# Altium project Service_board.PrjPcb (part 7 of 9)
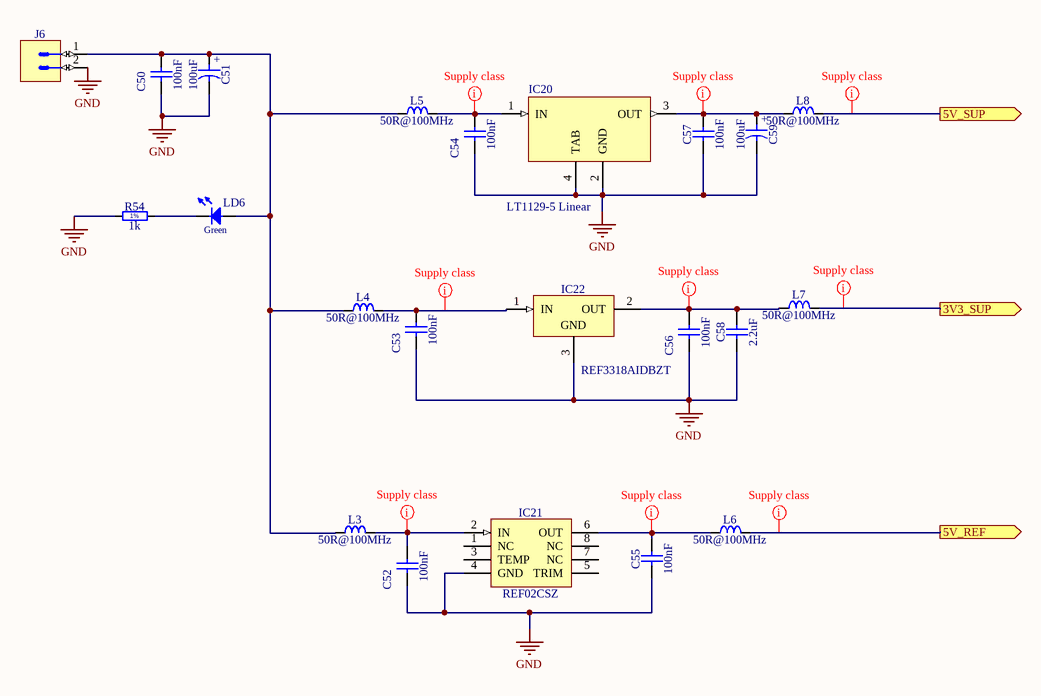
[diagram p12: Regulators.SchDoc]
## Nets that join several sheets
DVDD: MCU (32 pins), U_Bank (C1_U_Bank#1.2 IC1_U_Bank#1.16), U_Bank/U_Channel/U_TRD (C45_U_Bank_U_Channel_U_TRD#1.2 C46_U_Bank_U_Channel_U_TRD#1.1 U2_U_Bank_U_Channel_U_TRD#1.19 U2_U_Bank_U_Channel_U_TRD#1.20), U_Bank/U_Channel/U_TRD (C45_U_Bank_U_Channel_U_TRD#2.2 C46_U_Bank_U_Channel_U_TRD#2.1 U2_U_Bank_U_Channel_U_TRD#2.19 U2_U_Bank_U_Channel_U_TRD#2.20), U_Bank/U_Channel/U_TRD (C45_U_Bank_U_Channel_U_TRD#3.2 C46_U_Bank_U_Channel_U_TRD#3.1 U2_U_Bank_U_Channel_U_TRD#3.19 U2_U_Bank_U_Channel_U_TRD#3.20), U_Bank/U_Channel/U_TRD (C45_U_Bank_U_Channel_U_TRD#4.2 C46_U_Bank_U_Channel_U_TRD#4.1 U2_U_Bank_U_Channel_U_TRD#4.19 U2_U_Bank_U_Channel_U_TRD#4.20), U_Bank/U_Channel/U_TRD (C45_U_Bank_U_Channel_U_TRD#5.2 C46_U_Bank_U_Channel_U_TRD#5.1 U2_U_Bank_U_Channel_U_TRD#5.19 U2_U_Bank_U_Channel_U_TRD#5.20), U_Bank/U_Channel/U_TRD (C45_U_Bank_U_Channel_U_TRD#6.2 C46_U_Bank_U_Channel_U_TRD#6.1 U2_U_Bank_U_Channel_U_TRD#6.19 U2_U_Bank_U_Channel_U_TRD#6.20), U_Bank/U_Channel/U_TRD (C45_U_Bank_U_Channel_U_TRD#7.2 C46_U_Bank_U_Channel_U_TRD#7.1 U2_U_Bank_U_Channel_U_TRD#7.19 U2_U_Bank_U_Channel_U_TRD#7.20), U_Bank/U_Channel/U_TRD (C45_U_Bank_U_Channel_U_TRD#8.2 C46_U_Bank_U_Channel_U_TRD#8.1 U2_U_Bank_U_Channel_U_TRD#8.19 U2_U_Bank_U_Channel_U_TRD#8.20), DAC (C49.2 IC18.12 IC18.15), Regulators (L7.2), U_Bank (C1_U_Bank#2.2 IC1_U_Bank#2.16), U_Bank/U_Channel/U_TRD (C45_U_Bank_U_Channel_U_TRD#9.2 C46_U_Bank_U_Channel_U_TRD#9.1 U2_U_Bank_U_Channel_U_TRD#9.19 U2_U_Bank_U_Channel_U_TRD#9.20), U_Bank/U_Channel/U_TRD (C45_U_Bank_U_Channel_U_TRD#10.2 C46_U_Bank_U_Channel_U_TRD#10.1 U2_U_Bank_U_Channel_U_TRD#10.19 U2_U_Bank_U_Channel_U_TRD#10.20), U_Bank/U_Channel/U_TRD (C45_U_Bank_U_Channel_U_TRD#11.2 C46_U_Bank_U_Channel_U_TRD#11.1 U2_U_Bank_U_Channel_U_TRD#11.19 U2_U_Bank_U_Channel_U_TRD#11.20), U_Bank/U_Channel/U_TRD (C45_U_Bank_U_Channel_U_TRD#12.2 C46_U_Bank_U_Channel_U_TRD#12.1 U2_U_Bank_U_Channel_U_TRD#12.19 U2_U_Bank_U_Channel_U_TRD#12.20), U_Bank/U_Channel/U_TRD (C45_U_Bank_U_Channel_U_TRD#13.2 C46_U_Bank_U_Channel_U_TRD#13.1 U2_U_Bank_U_Channel_U_TRD#13.19 U2_U_Bank_U_Channel_U_TRD#13.20), U_Bank/U_Channel/U_TRD (C45_U_Bank_U_Channel_U_TRD#14.2 C46_U_Bank_U_Channel_U_TRD#14.1 U2_U_Bank_U_Channel_U_TRD#14.19 U2_U_Bank_U_Channel_U_TRD#14.20), U_Bank/U_Channel/U_TRD (C45_U_Bank_U_Channel_U_TRD#15.2 C46_U_Bank_U_Channel_U_TRD#15.1 U2_U_Bank_U_Channel_U_TRD#15.19 U2_U_Bank_U_Channel_U_TRD#15.20), U_Bank/U_Channel/U_TRD (C45_U_Bank_U_Channel_U_TRD#16.2 C46_U_Bank_U_Channel_U_TRD#16.1 U2_U_Bank_U_Channel_U_TRD#16.19 U2_U_Bank_U_Channel_U_TRD#16.20), U_Bank (C1_U_Bank#3.2 IC1_U_Bank#3.16), U_Bank/U_Channel/U_TRD (C45_U_Bank_U_Channel_U_TRD#17.2 C46_U_Bank_U_Channel_U_TRD#17.1 U2_U_Bank_U_Channel_U_TRD#17.19 U2_U_Bank_U_Channel_U_TRD#17.20), U_Bank/U_Channel/U_TRD (C45_U_Bank_U_Channel_U_TRD#18.2 C46_U_Bank_U_Channel_U_TRD#18.1 U2_U_Bank_U_Channel_U_TRD#18.19 U2_U_Bank_U_Channel_U_TRD#18.20), U_Bank/U_Channel/U_TRD (C45_U_Bank_U_Channel_U_TRD#19.2 C46_U_Bank_U_Channel_U_TRD#19.1 U2_U_Bank_U_Channel_U_TRD#19.19 U2_U_Bank_U_Channel_U_TRD#19.20), U_Bank/U_Channel/U_TRD (C45_U_Bank_U_Channel_U_TRD#20.2 C46_U_Bank_U_Channel_U_TRD#20.1 U2_U_Bank_U_Channel_U_TRD#20.19 U2_U_Bank_U_Channel_U_TRD#20.20), U_Bank/U_Channel/U_TRD (C45_U_Bank_U_Channel_U_TRD#21.2 C46_U_Bank_U_Channel_U_TRD#21.1 U2_U_Bank_U_Channel_U_TRD#21.19 U2_U_Bank_U_Channel_U_TRD#21.20), U_Bank/U_Channel/U_TRD (C45_U_Bank_U_Channel_U_TRD#22.2 C46_U_Bank_U_Channel_U_TRD#22.1 U2_U_Bank_U_Channel_U_TRD#22.19 U2_U_Bank_U_Channel_U_TRD#22.20), U_Bank/U_Channel/U_TRD (C45_U_Bank_U_Channel_U_TRD#23.2 C46_U_Bank_U_Channel_U_TRD#23.1 U2_U_Bank_U_Channel_U_TRD#23.19 U2_U_Bank_U_Channel_U_TRD#23.20), U_Bank/U_Channel/U_TRD (C45_U_Bank_U_Channel_U_TRD#24.2 C46_U_Bank_U_Channel_U_TRD#24.1 U2_U_Bank_U_Channel_U_TRD#24.19 U2_U_Bank_U_Channel_U_TRD#24.20), U_Bank (C1_U_Bank#4.2 IC1_U_Bank#4.16), U_Bank/U_Channel/U_TRD (C45_U_Bank_U_Channel_U_TRD#25.2 C46_U_Bank_U_Channel_U_TRD#25.1 U2_U_Bank_U_Channel_U_TRD#25.19 U2_U_Bank_U_Channel_U_TRD#25.20), U_Bank/U_Channel/U_TRD (C45_U_Bank_U_Channel_U_TRD#26.2 C46_U_Bank_U_Channel_U_TRD#26.1 U2_U_Bank_U_Channel_U_TRD#26.19 U2_U_Bank_U_Channel_U_TRD#26.20), U_Bank/U_Channel/U_TRD (C45_U_Bank_U_Channel_U_TRD#27.2 C46_U_Bank_U_Channel_U_TRD#27.1 U2_U_Bank_U_Channel_U_TRD#27.19 U2_U_Bank_U_Channel_U_TRD#27.20), U_Bank/U_Channel/U_TRD (C45_U_Bank_U_Channel_U_TRD#28.2 C46_U_Bank_U_Channel_U_TRD#28.1 U2_U_Bank_U_Channel_U_TRD#28.19 U2_U_Bank_U_Channel_U_TRD#28.20), U_Bank/U_Channel/U_TRD (C45_U_Bank_U_Channel_U_TRD#29.2 C46_U_Bank_U_Channel_U_TRD#29.1 U2_U_Bank_U_Channel_U_TRD#29.19 U2_U_Bank_U_Channel_U_TRD#29.20), U_Bank/U_Channel/U_TRD (C45_U_Bank_U_Channel_U_TRD#30.2 C46_U_Bank_U_Channel_U_TRD#30.1 U2_U_Bank_U_Channel_U_TRD#30.19 U2_U_Bank_U_Channel_U_TRD#30.20), U_Bank/U_Channel/U_TRD (C45_U_Bank_U_Channel_U_TRD#31.2 C46_U_Bank_U_Channel_U_TRD#31.1 U2_U_Bank_U_Channel_U_TRD#31.19 U2_U_Bank_U_Channel_U_TRD#31.20), U_Bank/U_Channel/U_TRD (C45_U_Bank_U_Channel_U_TRD#32.2 C46_U_Bank_U_Channel_U_TRD#32.1 U2_U_Bank_U_Channel_U_TRD#32.19 U2_U_Bank_U_Channel_U_TRD#32.20), U_Bank (C1_U_Bank#5.2 IC1_U_Bank#5.16), U_Bank/U_Channel/U_TRD (C45_U_Bank_U_Channel_U_TRD#33.2 C46_U_Bank_U_Channel_U_TRD#33.1 U2_U_Bank_U_Channel_U_TRD#33.19 U2_U_Bank_U_Channel_U_TRD#33.20), U_Bank/U_Channel/U_TRD (C45_U_Bank_U_Channel_U_TRD#34.2 C46_U_Bank_U_Channel_U_TRD#34.1 U2_U_Bank_U_Channel_U_TRD#34.19 U2_U_Bank_U_Channel_U_TRD#34.20), U_Bank/U_Channel/U_TRD (C45_U_Bank_U_Channel_U_TRD#35.2 C46_U_Bank_U_Channel_U_TRD#35.1 U2_U_Bank_U_Channel_U_TRD#35.19 U2_U_Bank_U_Channel_U_TRD#35.20), U_Bank/U_Channel/U_TRD (C45_U_Bank_U_Channel_U_TRD#36.2 C46_U_Bank_U_Channel_U_TRD#36.1 U2_U_Bank_U_Channel_U_TRD#36.19 U2_U_Bank_U_Channel_U_TRD#36.20), U_Bank/U_Channel/U_TRD (C45_U_Bank_U_Channel_U_TRD#37.2 C46_U_Bank_U_Channel_U_TRD#37.1 U2_U_Bank_U_Channel_U_TRD#37.19 U2_U_Bank_U_Channel_U_TRD#37.20), U_Bank/U_Channel/U_TRD (C45_U_Bank_U_Channel_U_TRD#38.2 C46_U_Bank_U_Channel_U_TRD#38.1 U2_U_Bank_U_Channel_U_TRD#38.19 U2_U_Bank_U_Channel_U_TRD#38.20), U_Bank/U_Channel/U_TRD (C45_U_Bank_U_Channel_U_TRD#39.2 C46_U_Bank_U_Channel_U_TRD#39.1 U2_U_Bank_U_Channel_U_TRD#39.19 U2_U_Bank_U_Channel_U_TRD#39.20), U_Bank/U_Channel/U_TRD (C45_U_Bank_U_Channel_U_TRD#40.2 C46_U_Bank_U_Channel_U_TRD#40.1 U2_U_Bank_U_Channel_U_TRD#40.19 U2_U_Bank_U_Channel_U_TRD#40.20), U_Bank (C1_U_Bank#6.2 IC1_U_Bank#6.16), U_Bank/U_Channel/U_TRD (C45_U_Bank_U_Channel_U_TRD#41.2 C46_U_Bank_U_Channel_U_TRD#41.1 U2_U_Bank_U_Channel_U_TRD#41.19 U2_U_Bank_U_Channel_U_TRD#41.20), U_Bank/U_Channel/U_TRD (C45_U_Bank_U_Channel_U_TRD#42.2 C46_U_Bank_U_Channel_U_TRD#42.1 U2_U_Bank_U_Channel_U_TRD#42.19 U2_U_Bank_U_Channel_U_TRD#42.20), U_Bank/U_Channel/U_TRD (C45_U_Bank_U_Channel_U_TRD#43.2 C46_U_Bank_U_Channel_U_TRD#43.1 U2_U_Bank_U_Channel_U_TRD#43.19 U2_U_Bank_U_Channel_U_TRD#43.20), U_Bank/U_Channel/U_TRD (C45_U_Bank_U_Channel_U_TRD#44.2 C46_U_Bank_U_Channel_U_TRD#44.1 U2_U_Bank_U_Channel_U_TRD#44.19 U2_U_Bank_U_Channel_U_TRD#44.20), U_Bank/U_Channel/U_TRD (C45_U_Bank_U_Channel_U_TRD#45.2 C46_U_Bank_U_Channel_U_TRD#45.1 U2_U_Bank_U_Channel_U_TRD#45.19 U2_U_Bank_U_Channel_U_TRD#45.20), U_Bank/U_Channel/U_TRD (C45_U_Bank_U_Channel_U_TRD#46.2 C46_U_Bank_U_Channel_U_TRD#46.1 U2_U_Bank_U_Channel_U_TRD#46.19 U2_U_Bank_U_Channel_U_TRD#46.20), U_Bank/U_Channel/U_TRD (C45_U_Bank_U_Channel_U_TRD#47.2 C46_U_Bank_U_Channel_U_TRD#47.1 U2_U_Bank_U_Channel_U_TRD#47.19 U2_U_Bank_U_Channel_U_TRD#47.20), U_Bank/U_Channel/U_TRD (C45_U_Bank_U_Channel_U_TRD#48.2 C46_U_Bank_U_Channel_U_TRD#48.1 U2_U_Bank_U_Channel_U_TRD#48.19 U2_U_Bank_U_Channel_U_TRD#48.20)
GND: Main (P5.3 P6.3), Pulser (14 pins), HV_boost (27 pins), MCU (40 pins), U_Bank (C1_U_Bank#1.1 IC1_U_Bank#1.8 IC1_U_Bank#1.13), U_Bank/U_Channel (IC2_U_Bank_U_Channel#1.10), U_Bank/U_Channel/U_TRD (8 pins), U_Bank/U_Channel/U_Switch (21 pins), U_Bank/U_Channel/U_TRD (8 pins), U_Bank/U_Channel/U_Switch (21 pins), U_Bank/U_Channel (IC2_U_Bank_U_Channel#2.10), U_Bank/U_Channel/U_TRD (8 pins), U_Bank/U_Channel/U_Switch (21 pins), U_Bank/U_Channel/U_TRD (8 pins), U_Bank/U_Channel/U_Switch (21 pins), U_Bank/U_Channel (IC2_U_Bank_U_Channel#3.10), U_Bank/U_Channel/U_TRD (8 pins), U_Bank/U_Channel/U_Switch (21 pins), U_Bank/U_Channel/U_TRD (8 pins), U_Bank/U_Channel/U_Switch (21 pins), U_Bank/U_Channel (IC2_U_Bank_U_Channel#4.10), U_Bank/U_Channel/U_TRD (8 pins), U_Bank/U_Channel/U_Switch (21 pins), U_Bank/U_Channel/U_TRD (8 pins), U_Bank/U_Channel/U_Switch (21 pins), DAC (9 pins), Regulators (16 pins), U_Bank (C1_U_Bank#2.1 IC1_U_Bank#2.8 IC1_U_Bank#2.13), U_Bank/U_Channel (IC2_U_Bank_U_Channel#5.10), U_Bank/U_Channel/U_TRD (8 pins), U_Bank/U_Channel/U_Switch (21 pins), U_Bank/U_Channel/U_TRD (8 pins), U_Bank/U_Channel/U_Switch (21 pins), U_Bank/U_Channel (IC2_U_Bank_U_Channel#6.10), U_Bank/U_Channel/U_TRD (8 pins), U_Bank/U_Channel/U_Switch (21 pins), U_Bank/U_Channel/U_TRD (8 pins), U_Bank/U_Channel/U_Switch (21 pins), U_Bank/U_Channel (IC2_U_Bank_U_Channel#7.10), U_Bank/U_Channel/U_TRD (8 pins), U_Bank/U_Channel/U_Switch (21 pins), U_Bank/U_Channel/U_TRD (8 pins), U_Bank/U_Channel/U_Switch (21 pins), U_Bank/U_Channel (IC2_U_Bank_U_Channel#8.10), U_Bank/U_Channel/U_TRD (8 pins), U_Bank/U_Channel/U_Switch (21 pins), U_Bank/U_Channel/U_TRD (8 pins), U_Bank/U_Channel/U_Switch (21 pins), U_Bank (C1_U_Bank#3.1 IC1_U_Bank#3.8 IC1_U_Bank#3.13), U_Bank/U_Channel (IC2_U_Bank_U_Channel#9.10), U_Bank/U_Channel/U_TRD (8 pins), U_Bank/U_Channel/U_Switch (21 pins), U_Bank/U_Channel/U_TRD (8 pins), U_Bank/U_Channel/U_Switch (21 pins), U_Bank/U_Channel (IC2_U_Bank_U_Channel#10.10), U_Bank/U_Channel/U_TRD (8 pins), U_Bank/U_Channel/U_Switch (21 pins), U_Bank/U_Channel/U_TRD (8 pins), U_Bank/U_Channel/U_Switch (21 pins), U_Bank/U_Channel (IC2_U_Bank_U_Channel#11.10), U_Bank/U_Channel/U_TRD (8 pins), U_Bank/U_Channel/U_Switch (21 pins), U_Bank/U_Channel/U_TRD (8 pins), U_Bank/U_Channel/U_Switch (21 pins), U_Bank/U_Channel (IC2_U_Bank_U_Channel#12.10), U_Bank/U_Channel/U_TRD (8 pins), U_Bank/U_Channel/U_Switch (21 pins), U_Bank/U_Channel/U_TRD (8 pins), U_Bank/U_Channel/U_Switch (21 pins), U_Bank (C1_U_Bank#4.1 IC1_U_Bank#4.8 IC1_U_Bank#4.13), U_Bank/U_Channel (IC2_U_Bank_U_Channel#13.10), U_Bank/U_Channel/U_TRD (8 pins), U_Bank/U_Channel/U_Switch (21 pins), U_Bank/U_Channel/U_TRD (8 pins), U_Bank/U_Channel/U_Switch (21 pins), U_Bank/U_Channel (IC2_U_Bank_U_Channel#14.10), U_Bank/U_Channel/U_TRD (8 pins), U_Bank/U_Channel/U_Switch (21 pins), U_Bank/U_Channel/U_TRD (8 pins), U_Bank/U_Channel/U_Switch (21 pins), U_Bank/U_Channel (IC2_U_Bank_U_Channel#15.10), U_Bank/U_Channel/U_TRD (8 pins), U_Bank/U_Channel/U_Switch (21 pins), U_Bank/U_Channel/U_TRD (8 pins), U_Bank/U_Channel/U_Switch (21 pins), U_Bank/U_Channel (IC2_U_Bank_U_Channel#16.10), U_Bank/U_Channel/U_TRD (8 pins), U_Bank/U_Channel/U_Switch (21 pins), U_Bank/U_Channel/U_TRD (8 pins), U_Bank/U_Channel/U_Switch (21 pins), U_Bank (C1_U_Bank#5.1 IC1_U_Bank#5.8 IC1_U_Bank#5.13), U_Bank/U_Channel (IC2_U_Bank_U_Channel#17.10), U_Bank/U_Channel/U_TRD (8 pins), U_Bank/U_Channel/U_Switch (21 pins), U_Bank/U_Channel/U_TRD (8 pins), U_Bank/U_Channel/U_Switch (21 pins), U_Bank/U_Channel (IC2_U_Bank_U_Channel#18.10), U_Bank/U_Channel/U_TRD (8 pins), U_Bank/U_Channel/U_Switch (21 pins), U_Bank/U_Channel/U_TRD (8 pins), U_Bank/U_Channel/U_Switch (21 pins), U_Bank/U_Channel (IC2_U_Bank_U_Channel#19.10), U_Bank/U_Channel/U_TRD (8 pins), U_Bank/U_Channel/U_Switch (21 pins), U_Bank/U_Channel/U_TRD (8 pins), U_Bank/U_Channel/U_Switch (21 pins), U_Bank/U_Channel (IC2_U_Bank_U_Channel#20.10), U_Bank/U_Channel/U_TRD (8 pins), U_Bank/U_Channel/U_Switch (21 pins), U_Bank/U_Channel/U_TRD (8 pins), U_Bank/U_Channel/U_Switch (21 pins), U_Bank (C1_U_Bank#6.1 IC1_U_Bank#6.8 IC1_U_Bank#6.13), U_Bank/U_Channel (IC2_U_Bank_U_Channel#21.10), U_Bank/U_Channel/U_TRD (8 pins), U_Bank/U_Channel/U_Switch (21 pins), U_Bank/U_Channel/U_TRD (8 pins), U_Bank/U_Channel/U_Switch (21 pins), U_Bank/U_Channel (IC2_U_Bank_U_Channel#22.10), U_Bank/U_Channel/U_TRD (8 pins), U_Bank/U_Channel/U_Switch (21 pins), U_Bank/U_Channel/U_TRD (8 pins), U_Bank/U_Channel/U_Switch (21 pins), U_Bank/U_Channel (IC2_U_Bank_U_Channel#23.10), U_Bank/U_Channel/U_TRD (8 pins), U_Bank/U_Channel/U_Switch (21 pins), U_Bank/U_Channel/U_TRD (8 pins), U_Bank/U_Channel/U_Switch (21 pins), U_Bank/U_Channel (IC2_U_Bank_U_Channel#24.10), U_Bank/U_Channel/U_TRD (8 pins), U_Bank/U_Channel/U_Switch (21 pins), U_Bank/U_Channel/U_TRD (8 pins), U_Bank/U_Channel/U_Switch (21 pins)
VCC: MCU (12 pins), U_Bank/U_Channel (IC2_U_Bank_U_Channel#1.20), U_Bank/U_Channel (IC2_U_Bank_U_Channel#2.20), U_Bank/U_Channel (IC2_U_Bank_U_Channel#3.20), U_Bank/U_Channel (IC2_U_Bank_U_Channel#4.20), U_Bank/U_Channel (IC2_U_Bank_U_Channel#5.20), U_Bank/U_Channel (IC2_U_Bank_U_Channel#6.20), U_Bank/U_Channel (IC2_U_Bank_U_Channel#7.20), U_Bank/U_Channel (IC2_U_Bank_U_Channel#8.20), U_Bank/U_Channel (IC2_U_Bank_U_Channel#9.20), U_Bank/U_Channel (IC2_U_Bank_U_Channel#10.20), U_Bank/U_Channel (IC2_U_Bank_U_Channel#11.20), U_Bank/U_Channel (IC2_U_Bank_U_Channel#12.20), U_Bank/U_Channel (IC2_U_Bank_U_Channel#13.20), U_Bank/U_Channel (IC2_U_Bank_U_Channel#14.20), U_Bank/U_Channel (IC2_U_Bank_U_Channel#15.20), U_Bank/U_Channel (IC2_U_Bank_U_Channel#16.20), U_Bank/U_Channel (IC2_U_Bank_U_Channel#17.20), U_Bank/U_Channel (IC2_U_Bank_U_Channel#18.20), U_Bank/U_Channel (IC2_U_Bank_U_Channel#19.20), U_Bank/U_Channel (IC2_U_Bank_U_Channel#20.20), U_Bank/U_Channel (IC2_U_Bank_U_Channel#21.20), U_Bank/U_Channel (IC2_U_Bank_U_Channel#22.20), U_Bank/U_Channel (IC2_U_Bank_U_Channel#23.20), U_Bank/U_Channel (IC2_U_Bank_U_Channel#24.20)
VDD: U_Bank/U_Channel/U_TRD (IC17_U_Bank_U_Channel_U_TRD#1.5), U_Bank/U_Channel/U_TRD (IC17_U_Bank_U_Channel_U_TRD#2.5), U_Bank/U_Channel/U_TRD (IC17_U_Bank_U_Channel_U_TRD#3.5), U_Bank/U_Channel/U_TRD (IC17_U_Bank_U_Channel_U_TRD#4.5), U_Bank/U_Channel/U_TRD (IC17_U_Bank_U_Channel_U_TRD#5.5), U_Bank/U_Channel/U_TRD (IC17_U_Bank_U_Channel_U_TRD#6.5), U_Bank/U_Channel/U_TRD (IC17_U_Bank_U_Channel_U_TRD#7.5), U_Bank/U_Channel/U_TRD (IC17_U_Bank_U_Channel_U_TRD#8.5), U_Bank/U_Channel/U_TRD (IC17_U_Bank_U_Channel_U_TRD#9.5), U_Bank/U_Channel/U_TRD (IC17_U_Bank_U_Channel_U_TRD#10.5), U_Bank/U_Channel/U_TRD (IC17_U_Bank_U_Channel_U_TRD#11.5), U_Bank/U_Channel/U_TRD (IC17_U_Bank_U_Channel_U_TRD#12.5), U_Bank/U_Channel/U_TRD (IC17_U_Bank_U_Channel_U_TRD#13.5), U_Bank/U_Channel/U_TRD (IC17_U_Bank_U_Channel_U_TRD#14.5), U_Bank/U_Channel/U_TRD (IC17_U_Bank_U_Channel_U_TRD#15.5), U_Bank/U_Channel/U_TRD (IC17_U_Bank_U_Channel_U_TRD#16.5), U_Bank/U_Channel/U_TRD (IC17_U_Bank_U_Channel_U_TRD#17.5), U_Bank/U_Channel/U_TRD (IC17_U_Bank_U_Channel_U_TRD#18.5), U_Bank/U_Channel/U_TRD (IC17_U_Bank_U_Channel_U_TRD#19.5), U_Bank/U_Channel/U_TRD (IC17_U_Bank_U_Channel_U_TRD#20.5), U_Bank/U_Channel/U_TRD (IC17_U_Bank_U_Channel_U_TRD#21.5), U_Bank/U_Channel/U_TRD (IC17_U_Bank_U_Channel_U_TRD#22.5), U_Bank/U_Channel/U_TRD (IC17_U_Bank_U_Channel_U_TRD#23.5), U_Bank/U_Channel/U_TRD (IC17_U_Bank_U_Channel_U_TRD#24.5), U_Bank/U_Channel/U_TRD (IC17_U_Bank_U_Channel_U_TRD#25.5), U_Bank/U_Channel/U_TRD (IC17_U_Bank_U_Channel_U_TRD#26.5), U_Bank/U_Channel/U_TRD (IC17_U_Bank_U_Channel_U_TRD#27.5), U_Bank/U_Channel/U_TRD (IC17_U_Bank_U_Channel_U_TRD#28.5), U_Bank/U_Channel/U_TRD (IC17_U_Bank_U_Channel_U_TRD#29.5), U_Bank/U_Channel/U_TRD (IC17_U_Bank_U_Channel_U_TRD#30.5), U_Bank/U_Channel/U_TRD (IC17_U_Bank_U_Channel_U_TRD#31.5), U_Bank/U_Channel/U_TRD (IC17_U_Bank_U_Channel_U_TRD#32.5), U_Bank/U_Channel/U_TRD (IC17_U_Bank_U_Channel_U_TRD#33.5), U_Bank/U_Channel/U_TRD (IC17_U_Bank_U_Channel_U_TRD#34.5), U_Bank/U_Channel/U_TRD (IC17_U_Bank_U_Channel_U_TRD#35.5), U_Bank/U_Channel/U_TRD (IC17_U_Bank_U_Channel_U_TRD#36.5), U_Bank/U_Channel/U_TRD (IC17_U_Bank_U_Channel_U_TRD#37.5), U_Bank/U_Channel/U_TRD (IC17_U_Bank_U_Channel_U_TRD#38.5), U_Bank/U_Channel/U_TRD (IC17_U_Bank_U_Channel_U_TRD#39.5), U_Bank/U_Channel/U_TRD (IC17_U_Bank_U_Channel_U_TRD#40.5), U_Bank/U_Channel/U_TRD (IC17_U_Bank_U_Channel_U_TRD#41.5), U_Bank/U_Channel/U_TRD (IC17_U_Bank_U_Channel_U_TRD#42.5), U_Bank/U_Channel/U_TRD (IC17_U_Bank_U_Channel_U_TRD#43.5), U_Bank/U_Channel/U_TRD (IC17_U_Bank_U_Channel_U_TRD#44.5), U_Bank/U_Channel/U_TRD (IC17_U_Bank_U_Channel_U_TRD#45.5), U_Bank/U_Channel/U_TRD (IC17_U_Bank_U_Channel_U_TRD#46.5), U_Bank/U_Channel/U_TRD (IC17_U_Bank_U_Channel_U_TRD#47.5), U_Bank/U_Channel/U_TRD (IC17_U_Bank_U_Channel_U_TRD#48.5)
Net=_Name_+_'_'_+_Manufacturer1_10: Pulser (12 pins), HV_boost (8 pins), DAC (R52.1), Regulators (L8.2)
NetC41_U_Bank_U_Channel_U_Switch#1_1: U_Bank/U_Channel/U_Switch (17 pins), U_Bank/U_Channel/U_Switch (17 pins), U_Bank/U_Channel/U_Switch (17 pins), U_Bank/U_Channel/U_Switch (17 pins), U_Bank/U_Channel/U_Switch (17 pins), U_Bank/U_Channel/U_Switch (17 pins), U_Bank/U_Channel/U_Switch (17 pins), U_Bank/U_Channel/U_Switch (17 pins), U_Bank/U_Channel/U_Switch (17 pins), U_Bank/U_Channel/U_Switch (17 pins), U_Bank/U_Channel/U_Switch (17 pins), U_Bank/U_Channel/U_Switch (17 pins), U_Bank/U_Channel/U_Switch (17 pins), U_Bank/U_Channel/U_Switch (17 pins), U_Bank/U_Channel/U_Switch (17 pins), U_Bank/U_Channel/U_Switch (17 pins), U_Bank/U_Channel/U_Switch (17 pins), U_Bank/U_Channel/U_Switch (17 pins), U_Bank/U_Channel/U_Switch (17 pins), U_Bank/U_Channel/U_Switch (17 pins), U_Bank/U_Channel/U_Switch (17 pins), U_Bank/U_Channel/U_Switch (17 pins), U_Bank/U_Channel/U_Switch (17 pins), U_Bank/U_Channel/U_Switch (17 pins), U_Bank/U_Channel/U_Switch (17 pins), U_Bank/U_Channel/U_Switch (17 pins), U_Bank/U_Channel/U_Switch (17 pins), U_Bank/U_Channel/U_Switch (17 pins), U_Bank/U_Channel/U_Switch (17 pins), U_Bank/U_Channel/U_Switch (17 pins), U_Bank/U_Channel/U_Switch (17 pins), U_Bank/U_Channel/U_Switch (17 pins), U_Bank/U_Channel/U_Switch (17 pins), U_Bank/U_Channel/U_Switch (17 pins), U_Bank/U_Channel/U_Switch (17 pins), U_Bank/U_Channel/U_Switch (17 pins), U_Bank/U_Channel/U_Switch (17 pins), U_Bank/U_Channel/U_Switch (17 pins), U_Bank/U_Channel/U_Switch (17 pins), U_Bank/U_Channel/U_Switch (17 pins), U_Bank/U_Channel/U_Switch (17 pins), U_Bank/U_Channel/U_Switch (17 pins), U_Bank/U_Channel/U_Switch (17 pins), U_Bank/U_Channel/U_Switch (17 pins), U_Bank/U_Channel/U_Switch (17 pins), U_Bank/U_Channel/U_Switch (17 pins), U_Bank/U_Channel/U_Switch (17 pins), U_Bank/U_Channel/U_Switch (17 pins)
NetC?#3_2: HV_boost (5 pins), U_Bank/U_Channel/U_Switch (R31_U_Bank_U_Channel_U_Switch#1.1 U1_U_Bank_U_Channel_U_Switch#1.4), U_Bank/U_Channel/U_Switch (R31_U_Bank_U_Channel_U_Switch#2.1 U1_U_Bank_U_Channel_U_Switch#2.4), U_Bank/U_Channel/U_Switch (R31_U_Bank_U_Channel_U_Switch#3.1 U1_U_Bank_U_Channel_U_Switch#3.4), U_Bank/U_Channel/U_Switch (R31_U_Bank_U_Channel_U_Switch#4.1 U1_U_Bank_U_Channel_U_Switch#4.4), U_Bank/U_Channel/U_Switch (R31_U_Bank_U_Channel_U_Switch#5.1 U1_U_Bank_U_Channel_U_Switch#5.4), U_Bank/U_Channel/U_Switch (R31_U_Bank_U_Channel_U_Switch#6.1 U1_U_Bank_U_Channel_U_Switch#6.4), U_Bank/U_Channel/U_Switch (R31_U_Bank_U_Channel_U_Switch#7.1 U1_U_Bank_U_Channel_U_Switch#7.4), U_Bank/U_Channel/U_Switch (R31_U_Bank_U_Channel_U_Switch#8.1 U1_U_Bank_U_Channel_U_Switch#8.4), U_Bank/U_Channel/U_Switch (R31_U_Bank_U_Channel_U_Switch#9.1 U1_U_Bank_U_Channel_U_Switch#9.4), U_Bank/U_Channel/U_Switch (R31_U_Bank_U_Channel_U_Switch#10.1 U1_U_Bank_U_Channel_U_Switch#10.4), U_Bank/U_Channel/U_Switch (R31_U_Bank_U_Channel_U_Switch#11.1 U1_U_Bank_U_Channel_U_Switch#11.4), U_Bank/U_Channel/U_Switch (R31_U_Bank_U_Channel_U_Switch#12.1 U1_U_Bank_U_Channel_U_Switch#12.4), U_Bank/U_Channel/U_Switch (R31_U_Bank_U_Channel_U_Switch#13.1 U1_U_Bank_U_Channel_U_Switch#13.4), U_Bank/U_Channel/U_Switch (R31_U_Bank_U_Channel_U_Switch#14.1 U1_U_Bank_U_Channel_U_Switch#14.4), U_Bank/U_Channel/U_Switch (R31_U_Bank_U_Channel_U_Switch#15.1 U1_U_Bank_U_Channel_U_Switch#15.4), U_Bank/U_Channel/U_Switch (R31_U_Bank_U_Channel_U_Switch#16.1 U1_U_Bank_U_Channel_U_Switch#16.4), U_Bank/U_Channel/U_Switch (R31_U_Bank_U_Channel_U_Switch#17.1 U1_U_Bank_U_Channel_U_Switch#17.4), U_Bank/U_Channel/U_Switch (R31_U_Bank_U_Channel_U_Switch#18.1 U1_U_Bank_U_Channel_U_Switch#18.4), U_Bank/U_Channel/U_Switch (R31_U_Bank_U_Channel_U_Switch#19.1 U1_U_Bank_U_Channel_U_Switch#19.4), U_Bank/U_Channel/U_Switch (R31_U_Bank_U_Channel_U_Switch#20.1 U1_U_Bank_U_Channel_U_Switch#20.4), U_Bank/U_Channel/U_Switch (R31_U_Bank_U_Channel_U_Switch#21.1 U1_U_Bank_U_Channel_U_Switch#21.4), U_Bank/U_Channel/U_Switch (R31_U_Bank_U_Channel_U_Switch#22.1 U1_U_Bank_U_Channel_U_Switch#22.4), U_Bank/U_Channel/U_Switch (R31_U_Bank_U_Channel_U_Switch#23.1 U1_U_Bank_U_Channel_U_Switch#23.4), U_Bank/U_Channel/U_Switch (R31_U_Bank_U_Channel_U_Switch#24.1 U1_U_Bank_U_Channel_U_Switch#24.4), U_Bank/U_Channel/U_Switch (R31_U_Bank_U_Channel_U_Switch#25.1 U1_U_Bank_U_Channel_U_Switch#25.4), U_Bank/U_Channel/U_Switch (R31_U_Bank_U_Channel_U_Switch#26.1 U1_U_Bank_U_Channel_U_Switch#26.4), U_Bank/U_Channel/U_Switch (R31_U_Bank_U_Channel_U_Switch#27.1 U1_U_Bank_U_Channel_U_Switch#27.4), U_Bank/U_Channel/U_Switch (R31_U_Bank_U_Channel_U_Switch#28.1 U1_U_Bank_U_Channel_U_Switch#28.4), U_Bank/U_Channel/U_Switch (R31_U_Bank_U_Channel_U_Switch#29.1 U1_U_Bank_U_Channel_U_Switch#29.4), U_Bank/U_Channel/U_Switch (R31_U_Bank_U_Channel_U_Switch#30.1 U1_U_Bank_U_Channel_U_Switch#30.4), U_Bank/U_Channel/U_Switch (R31_U_Bank_U_Channel_U_Switch#31.1 U1_U_Bank_U_Channel_U_Switch#31.4), U_Bank/U_Channel/U_Switch (R31_U_Bank_U_Channel_U_Switch#32.1 U1_U_Bank_U_Channel_U_Switch#32.4), U_Bank/U_Channel/U_Switch (R31_U_Bank_U_Channel_U_Switch#33.1 U1_U_Bank_U_Channel_U_Switch#33.4), U_Bank/U_Channel/U_Switch (R31_U_Bank_U_Channel_U_Switch#34.1 U1_U_Bank_U_Channel_U_Switch#34.4), U_Bank/U_Channel/U_Switch (R31_U_Bank_U_Channel_U_Switch#35.1 U1_U_Bank_U_Channel_U_Switch#35.4), U_Bank/U_Channel/U_Switch (R31_U_Bank_U_Channel_U_Switch#36.1 U1_U_Bank_U_Channel_U_Switch#36.4), U_Bank/U_Channel/U_Switch (R31_U_Bank_U_Channel_U_Switch#37.1 U1_U_Bank_U_Channel_U_Switch#37.4), U_Bank/U_Channel/U_Switch (R31_U_Bank_U_Channel_U_Switch#38.1 U1_U_Bank_U_Channel_U_Switch#38.4), U_Bank/U_Channel/U_Switch (R31_U_Bank_U_Channel_U_Switch#39.1 U1_U_Bank_U_Channel_U_Switch#39.4), U_Bank/U_Channel/U_Switch (R31_U_Bank_U_Channel_U_Switch#40.1 U1_U_Bank_U_Channel_U_Switch#40.4), U_Bank/U_Channel/U_Switch (R31_U_Bank_U_Channel_U_Switch#41.1 U1_U_Bank_U_Channel_U_Switch#41.4), U_Bank/U_Channel/U_Switch (R31_U_Bank_U_Channel_U_Switch#42.1 U1_U_Bank_U_Channel_U_Switch#42.4), U_Bank/U_Channel/U_Switch (R31_U_Bank_U_Channel_U_Switch#43.1 U1_U_Bank_U_Channel_U_Switch#43.4), U_Bank/U_Channel/U_Switch (R31_U_Bank_U_Channel_U_Switch#44.1 U1_U_Bank_U_Channel_U_Switch#44.4), U_Bank/U_Channel/U_Switch (R31_U_Bank_U_Channel_U_Switch#45.1 U1_U_Bank_U_Channel_U_Switch#45.4), U_Bank/U_Channel/U_Switch (R31_U_Bank_U_Channel_U_Switch#46.1 U1_U_Bank_U_Channel_U_Switch#46.4), U_Bank/U_Channel/U_Switch (R31_U_Bank_U_Channel_U_Switch#47.1 U1_U_Bank_U_Channel_U_Switch#47.4), U_Bank/U_Channel/U_Switch (R31_U_Bank_U_Channel_U_Switch#48.1 U1_U_Bank_U_Channel_U_Switch#48.4)
NetIC1_U_Bank#1_1: U_Bank (IC1_U_Bank#1.1), U_Bank/U_Channel (IC2_U_Bank_U_Channel#1.19), U_Bank/U_Channel/U_TRD (U2_U_Bank_U_Channel_U_TRD#2.13)
NetIC1_U_Bank#1_2: U_Bank (IC1_U_Bank#1.2), U_Bank/U_Channel (IC2_U_Bank_U_Channel#2.1), U_Bank/U_Channel/U_TRD (U2_U_Bank_U_Channel_U_TRD#3.13)
NetIC1_U_Bank#1_3: U_Bank (IC1_U_Bank#1.3), U_Bank/U_Channel (IC2_U_Bank_U_Channel#2.19), U_Bank/U_Channel/U_TRD (U2_U_Bank_U_Channel_U_TRD#4.13)
NetIC1_U_Bank#1_4: U_Bank (IC1_U_Bank#1.4), U_Bank/U_Channel (IC2_U_Bank_U_Channel#3.1), U_Bank/U_Channel/U_TRD (U2_U_Bank_U_Channel_U_TRD#5.13)
NetIC1_U_Bank#1_5: U_Bank (IC1_U_Bank#1.5), U_Bank/U_Channel (IC2_U_Bank_U_Channel#3.19), U_Bank/U_Channel/U_TRD (U2_U_Bank_U_Channel_U_TRD#6.13)
NetIC1_U_Bank#1_6: U_Bank (IC1_U_Bank#1.6), U_Bank/U_Channel (IC2_U_Bank_U_Channel#4.1), U_Bank/U_Channel/U_TRD (U2_U_Bank_U_Channel_U_TRD#7.13)
NetIC1_U_Bank#1_7: U_Bank (IC1_U_Bank#1.7), U_Bank/U_Channel (IC2_U_Bank_U_Channel#4.19), U_Bank/U_Channel/U_TRD (U2_U_Bank_U_Channel_U_TRD#8.13)
NetIC1_U_Bank#1_9: U_Bank (IC1_U_Bank#1.9), U_Bank (IC1_U_Bank#2.14)
NetIC1_U_Bank#1_10: MCU (IC8.42), U_Bank (IC1_U_Bank#1.10), U_Bank (IC1_U_Bank#2.10), U_Bank (IC1_U_Bank#3.10), U_Bank (IC1_U_Bank#4.10), U_Bank (IC1_U_Bank#5.10), U_Bank (IC1_U_Bank#6.10)
NetIC1_U_Bank#1_11: MCU (IC8.43), U_Bank (IC1_U_Bank#1.11), U_Bank (IC1_U_Bank#2.11), U_Bank (IC1_U_Bank#3.11), U_Bank (IC1_U_Bank#4.11), U_Bank (IC1_U_Bank#5.11), U_Bank (IC1_U_Bank#6.11)
NetIC1_U_Bank#1_12: MCU (IC8.41), U_Bank (IC1_U_Bank#1.12), U_Bank (IC1_U_Bank#2.12), U_Bank (IC1_U_Bank#3.12), U_Bank (IC1_U_Bank#4.12), U_Bank (IC1_U_Bank#5.12), U_Bank (IC1_U_Bank#6.12)
NetIC1_U_Bank#1_14: MCU (IC8.44), U_Bank (IC1_U_Bank#1.14)
NetIC1_U_Bank#1_15: U_Bank (IC1_U_Bank#1.15), U_Bank/U_Channel (IC2_U_Bank_U_Channel#1.1), U_Bank/U_Channel/U_TRD (U2_U_Bank_U_Channel_U_TRD#1.13)
NetIC1_U_Bank#2_1: U_Bank (IC1_U_Bank#2.1), U_Bank/U_Channel (IC2_U_Bank_U_Channel#5.19), U_Bank/U_Channel/U_TRD (U2_U_Bank_U_Channel_U_TRD#10.13)
NetIC1_U_Bank#2_2: U_Bank (IC1_U_Bank#2.2), U_Bank/U_Channel (IC2_U_Bank_U_Channel#6.1), U_Bank/U_Channel/U_TRD (U2_U_Bank_U_Channel_U_TRD#11.13)
NetIC1_U_Bank#2_3: U_Bank (IC1_U_Bank#2.3), U_Bank/U_Channel (IC2_U_Bank_U_Channel#6.19), U_Bank/U_Channel/U_TRD (U2_U_Bank_U_Channel_U_TRD#12.13)
NetIC1_U_Bank#2_4: U_Bank (IC1_U_Bank#2.4), U_Bank/U_Channel (IC2_U_Bank_U_Channel#7.1), U_Bank/U_Channel/U_TRD (U2_U_Bank_U_Channel_U_TRD#13.13)
NetIC1_U_Bank#2_5: U_Bank (IC1_U_Bank#2.5), U_Bank/U_Channel (IC2_U_Bank_U_Channel#7.19), U_Bank/U_Channel/U_TRD (U2_U_Bank_U_Channel_U_TRD#14.13)
NetIC1_U_Bank#2_6: U_Bank (IC1_U_Bank#2.6), U_Bank/U_Channel (IC2_U_Bank_U_Channel#8.1), U_Bank/U_Channel/U_TRD (U2_U_Bank_U_Channel_U_TRD#15.13)
NetIC1_U_Bank#2_7: U_Bank (IC1_U_Bank#2.7), U_Bank/U_Channel (IC2_U_Bank_U_Channel#8.19), U_Bank/U_Channel/U_TRD (U2_U_Bank_U_Channel_U_TRD#16.13)
NetIC1_U_Bank#2_9: U_Bank (IC1_U_Bank#2.9), U_Bank (IC1_U_Bank#3.14)
NetIC1_U_Bank#2_15: U_Bank (IC1_U_Bank#2.15), U_Bank/U_Channel (IC2_U_Bank_U_Channel#5.1), U_Bank/U_Channel/U_TRD (U2_U_Bank_U_Channel_U_TRD#9.13)
NetIC1_U_Bank#3_1: U_Bank (IC1_U_Bank#3.1), U_Bank/U_Channel (IC2_U_Bank_U_Channel#9.19), U_Bank/U_Channel/U_TRD (U2_U_Bank_U_Channel_U_TRD#18.13)
NetIC1_U_Bank#3_2: U_Bank (IC1_U_Bank#3.2), U_Bank/U_Channel (IC2_U_Bank_U_Channel#10.1), U_Bank/U_Channel/U_TRD (U2_U_Bank_U_Channel_U_TRD#19.13)
NetIC1_U_Bank#3_3: U_Bank (IC1_U_Bank#3.3), U_Bank/U_Channel (IC2_U_Bank_U_Channel#10.19), U_Bank/U_Channel/U_TRD (U2_U_Bank_U_Channel_U_TRD#20.13)
NetIC1_U_Bank#3_4: U_Bank (IC1_U_Bank#3.4), U_Bank/U_Channel (IC2_U_Bank_U_Channel#11.1), U_Bank/U_Channel/U_TRD (U2_U_Bank_U_Channel_U_TRD#21.13)
NetIC1_U_Bank#3_5: U_Bank (IC1_U_Bank#3.5), U_Bank/U_Channel (IC2_U_Bank_U_Channel#11.19), U_Bank/U_Channel/U_TRD (U2_U_Bank_U_Channel_U_TRD#22.13)
NetIC1_U_Bank#3_6: U_Bank (IC1_U_Bank#3.6), U_Bank/U_Channel (IC2_U_Bank_U_Channel#12.1), U_Bank/U_Channel/U_TRD (U2_U_Bank_U_Channel_U_TRD#23.13)
NetIC1_U_Bank#3_7: U_Bank (IC1_U_Bank#3.7), U_Bank/U_Channel (IC2_U_Bank_U_Channel#12.19), U_Bank/U_Channel/U_TRD (U2_U_Bank_U_Channel_U_TRD#24.13)
NetIC1_U_Bank#3_9: U_Bank (IC1_U_Bank#3.9), U_Bank (IC1_U_Bank#4.14)
NetIC1_U_Bank#3_15: U_Bank (IC1_U_Bank#3.15), U_Bank/U_Channel (IC2_U_Bank_U_Channel#9.1), U_Bank/U_Channel/U_TRD (U2_U_Bank_U_Channel_U_TRD#17.13)
NetIC1_U_Bank#4_1: U_Bank (IC1_U_Bank#4.1), U_Bank/U_Channel (IC2_U_Bank_U_Channel#13.19), U_Bank/U_Channel/U_TRD (U2_U_Bank_U_Channel_U_TRD#26.13)
NetIC1_U_Bank#4_2: U_Bank (IC1_U_Bank#4.2), U_Bank/U_Channel (IC2_U_Bank_U_Channel#14.1), U_Bank/U_Channel/U_TRD (U2_U_Bank_U_Channel_U_TRD#27.13)
NetIC1_U_Bank#4_3: U_Bank (IC1_U_Bank#4.3), U_Bank/U_Channel (IC2_U_Bank_U_Channel#14.19), U_Bank/U_Channel/U_TRD (U2_U_Bank_U_Channel_U_TRD#28.13)
NetIC1_U_Bank#4_4: U_Bank (IC1_U_Bank#4.4), U_Bank/U_Channel (IC2_U_Bank_U_Channel#15.1), U_Bank/U_Channel/U_TRD (U2_U_Bank_U_Channel_U_TRD#29.13)
NetIC1_U_Bank#4_5: U_Bank (IC1_U_Bank#4.5), U_Bank/U_Channel (IC2_U_Bank_U_Channel#15.19), U_Bank/U_Channel/U_TRD (U2_U_Bank_U_Channel_U_TRD#30.13)
NetIC1_U_Bank#4_6: U_Bank (IC1_U_Bank#4.6), U_Bank/U_Channel (IC2_U_Bank_U_Channel#16.1), U_Bank/U_Channel/U_TRD (U2_U_Bank_U_Channel_U_TRD#31.13)
NetIC1_U_Bank#4_7: U_Bank (IC1_U_Bank#4.7), U_Bank/U_Channel (IC2_U_Bank_U_Channel#16.19), U_Bank/U_Channel/U_TRD (U2_U_Bank_U_Channel_U_TRD#32.13)
NetIC1_U_Bank#4_9: U_Bank (IC1_U_Bank#4.9), U_Bank (IC1_U_Bank#5.14)
NetIC1_U_Bank#4_15: U_Bank (IC1_U_Bank#4.15), U_Bank/U_Channel (IC2_U_Bank_U_Channel#13.1), U_Bank/U_Channel/U_TRD (U2_U_Bank_U_Channel_U_TRD#25.13)
NetIC1_U_Bank#5_1: U_Bank (IC1_U_Bank#5.1), U_Bank/U_Channel (IC2_U_Bank_U_Channel#17.19), U_Bank/U_Channel/U_TRD (U2_U_Bank_U_Channel_U_TRD#34.13)
NetIC1_U_Bank#5_2: U_Bank (IC1_U_Bank#5.2), U_Bank/U_Channel (IC2_U_Bank_U_Channel#18.1), U_Bank/U_Channel/U_TRD (U2_U_Bank_U_Channel_U_TRD#35.13)
NetIC1_U_Bank#5_3: U_Bank (IC1_U_Bank#5.3), U_Bank/U_Channel (IC2_U_Bank_U_Channel#18.19), U_Bank/U_Channel/U_TRD (U2_U_Bank_U_Channel_U_TRD#36.13)
NetIC1_U_Bank#5_4: U_Bank (IC1_U_Bank#5.4), U_Bank/U_Channel (IC2_U_Bank_U_Channel#19.1), U_Bank/U_Channel/U_TRD (U2_U_Bank_U_Channel_U_TRD#37.13)
NetIC1_U_Bank#5_5: U_Bank (IC1_U_Bank#5.5), U_Bank/U_Channel (IC2_U_Bank_U_Channel#19.19), U_Bank/U_Channel/U_TRD (U2_U_Bank_U_Channel_U_TRD#38.13)
NetIC1_U_Bank#5_6: U_Bank (IC1_U_Bank#5.6), U_Bank/U_Channel (IC2_U_Bank_U_Channel#20.1), U_Bank/U_Channel/U_TRD (U2_U_Bank_U_Channel_U_TRD#39.13)
NetIC1_U_Bank#5_7: U_Bank (IC1_U_Bank#5.7), U_Bank/U_Channel (IC2_U_Bank_U_Channel#20.19), U_Bank/U_Channel/U_TRD (U2_U_Bank_U_Channel_U_TRD#40.13)
NetIC1_U_Bank#5_15: U_Bank (IC1_U_Bank#5.15), U_Bank/U_Channel (IC2_U_Bank_U_Channel#17.1), U_Bank/U_Channel/U_TRD (U2_U_Bank_U_Channel_U_TRD#33.13)
NetIC1_U_Bank#6_1: U_Bank (IC1_U_Bank#6.1), U_Bank/U_Channel (IC2_U_Bank_U_Channel#21.19), U_Bank/U_Channel/U_TRD (U2_U_Bank_U_Channel_U_TRD#42.13)
NetIC1_U_Bank#6_2: U_Bank (IC1_U_Bank#6.2), U_Bank/U_Channel (IC2_U_Bank_U_Channel#22.1), U_Bank/U_Channel/U_TRD (U2_U_Bank_U_Channel_U_TRD#43.13)
NetIC1_U_Bank#6_3: U_Bank (IC1_U_Bank#6.3), U_Bank/U_Channel (IC2_U_Bank_U_Channel#22.19), U_Bank/U_Channel/U_TRD (U2_U_Bank_U_Channel_U_TRD#44.13)
NetIC1_U_Bank#6_4: U_Bank (IC1_U_Bank#6.4), U_Bank/U_Channel (IC2_U_Bank_U_Channel#23.1), U_Bank/U_Channel/U_TRD (U2_U_Bank_U_Channel_U_TRD#45.13)
NetIC1_U_Bank#6_5: U_Bank (IC1_U_Bank#6.5), U_Bank/U_Channel (IC2_U_Bank_U_Channel#23.19), U_Bank/U_Channel/U_TRD (U2_U_Bank_U_Channel_U_TRD#46.13)
NetIC1_U_Bank#6_6: U_Bank (IC1_U_Bank#6.6), U_Bank/U_Channel (IC2_U_Bank_U_Channel#24.1), U_Bank/U_Channel/U_TRD (U2_U_Bank_U_Channel_U_TRD#47.13)
NetIC1_U_Bank#6_7: U_Bank (IC1_U_Bank#6.7), U_Bank/U_Channel (IC2_U_Bank_U_Channel#24.19), U_Bank/U_Channel/U_TRD (U2_U_Bank_U_Channel_U_TRD#48.13)
NetIC1_U_Bank#6_9: MCU (IC8.45), U_Bank (IC1_U_Bank#6.9)
NetIC1_U_Bank#6_15: U_Bank (IC1_U_Bank#6.15), U_Bank/U_Channel (IC2_U_Bank_U_Channel#21.1), U_Bank/U_Channel/U_TRD (U2_U_Bank_U_Channel_U_TRD#41.13)
NetIC2_U_Bank_U_Channel#1_2: MCU (IC8.27), U_Bank/U_Channel (IC2_U_Bank_U_Channel#1.2 IC2_U_Bank_U_Channel#1.17), U_Bank/U_Channel (IC2_U_Bank_U_Channel#2.2 IC2_U_Bank_U_Channel#2.17), U_Bank/U_Channel (IC2_U_Bank_U_Channel#3.2 IC2_U_Bank_U_Channel#3.17), U_Bank/U_Channel (IC2_U_Bank_U_Channel#4.2 IC2_U_Bank_U_Channel#4.17), U_Bank/U_Channel (IC2_U_Bank_U_Channel#5.2 IC2_U_Bank_U_Channel#5.17), U_Bank/U_Channel (IC2_U_Bank_U_Channel#6.2 IC2_U_Bank_U_Channel#6.17), U_Bank/U_Channel (IC2_U_Bank_U_Channel#7.2 IC2_U_Bank_U_Channel#7.17), U_Bank/U_Channel (IC2_U_Bank_U_Channel#8.2 IC2_U_Bank_U_Channel#8.17), U_Bank/U_Channel (IC2_U_Bank_U_Channel#9.2 IC2_U_Bank_U_Channel#9.17), U_Bank/U_Channel (IC2_U_Bank_U_Channel#10.2 IC2_U_Bank_U_Channel#10.17), U_Bank/U_Channel (IC2_U_Bank_U_Channel#11.2 IC2_U_Bank_U_Channel#11.17), U_Bank/U_Channel (IC2_U_Bank_U_Channel#12.2 IC2_U_Bank_U_Channel#12.17), U_Bank/U_Channel (IC2_U_Bank_U_Channel#13.2 IC2_U_Bank_U_Channel#13.17), U_Bank/U_Channel (IC2_U_Bank_U_Channel#14.2 IC2_U_Bank_U_Channel#14.17), U_Bank/U_Channel (IC2_U_Bank_U_Channel#15.2 IC2_U_Bank_U_Channel#15.17), U_Bank/U_Channel (IC2_U_Bank_U_Channel#16.2 IC2_U_Bank_U_Channel#16.17), U_Bank/U_Channel (IC2_U_Bank_U_Channel#17.2 IC2_U_Bank_U_Channel#17.17), U_Bank/U_Channel (IC2_U_Bank_U_Channel#18.2 IC2_U_Bank_U_Channel#18.17), U_Bank/U_Channel (IC2_U_Bank_U_Channel#19.2 IC2_U_Bank_U_Channel#19.17), U_Bank/U_Channel (IC2_U_Bank_U_Channel#20.2 IC2_U_Bank_U_Channel#20.17), U_Bank/U_Channel (IC2_U_Bank_U_Channel#21.2 IC2_U_Bank_U_Channel#21.17), U_Bank/U_Channel (IC2_U_Bank_U_Channel#22.2 IC2_U_Bank_U_Channel#22.17), U_Bank/U_Channel (IC2_U_Bank_U_Channel#23.2 IC2_U_Bank_U_Channel#23.17), U_Bank/U_Channel (IC2_U_Bank_U_Channel#24.2 IC2_U_Bank_U_Channel#24.17)
NetIC2_U_Bank_U_Channel#1_3: U_Bank/U_Channel (IC2_U_Bank_U_Channel#1.3), U_Bank/U_Channel/U_Switch (R46_U_Bank_U_Channel_U_Switch#2.2)
NetIC2_U_Bank_U_Channel#1_4: MCU (IC8.26), U_Bank/U_Channel (IC2_U_Bank_U_Channel#1.4 IC2_U_Bank_U_Channel#1.15), U_Bank/U_Channel (IC2_U_Bank_U_Channel#2.4 IC2_U_Bank_U_Channel#2.15), U_Bank/U_Channel (IC2_U_Bank_U_Channel#3.4 IC2_U_Bank_U_Channel#3.15), U_Bank/U_Channel (IC2_U_Bank_U_Channel#4.4 IC2_U_Bank_U_Channel#4.15), U_Bank/U_Channel (IC2_U_Bank_U_Channel#5.4 IC2_U_Bank_U_Channel#5.15), U_Bank/U_Channel (IC2_U_Bank_U_Channel#6.4 IC2_U_Bank_U_Channel#6.15), U_Bank/U_Channel (IC2_U_Bank_U_Channel#7.4 IC2_U_Bank_U_Channel#7.15), U_Bank/U_Channel (IC2_U_Bank_U_Channel#8.4 IC2_U_Bank_U_Channel#8.15), U_Bank/U_Channel (IC2_U_Bank_U_Channel#9.4 IC2_U_Bank_U_Channel#9.15), U_Bank/U_Channel (IC2_U_Bank_U_Channel#10.4 IC2_U_Bank_U_Channel#10.15), U_Bank/U_Channel (IC2_U_Bank_U_Channel#11.4 IC2_U_Bank_U_Channel#11.15), U_Bank/U_Channel (IC2_U_Bank_U_Channel#12.4 IC2_U_Bank_U_Channel#12.15), U_Bank/U_Channel (IC2_U_Bank_U_Channel#13.4 IC2_U_Bank_U_Channel#13.15), U_Bank/U_Channel (IC2_U_Bank_U_Channel#14.4 IC2_U_Bank_U_Channel#14.15), U_Bank/U_Channel (IC2_U_Bank_U_Channel#15.4 IC2_U_Bank_U_Channel#15.15), U_Bank/U_Channel (IC2_U_Bank_U_Channel#16.4 IC2_U_Bank_U_Channel#16.15), U_Bank/U_Channel (IC2_U_Bank_U_Channel#17.4 IC2_U_Bank_U_Channel#17.15), U_Bank/U_Channel (IC2_U_Bank_U_Channel#18.4 IC2_U_Bank_U_Channel#18.15), U_Bank/U_Channel (IC2_U_Bank_U_Channel#19.4 IC2_U_Bank_U_Channel#19.15), U_Bank/U_Channel (IC2_U_Bank_U_Channel#20.4 IC2_U_Bank_U_Channel#20.15), U_Bank/U_Channel (IC2_U_Bank_U_Channel#21.4 IC2_U_Bank_U_Channel#21.15), U_Bank/U_Channel (IC2_U_Bank_U_Channel#22.4 IC2_U_Bank_U_Channel#22.15), U_Bank/U_Channel (IC2_U_Bank_U_Channel#23.4 IC2_U_Bank_U_Channel#23.15), U_Bank/U_Channel (IC2_U_Bank_U_Channel#24.4 IC2_U_Bank_U_Channel#24.15)
NetIC2_U_Bank_U_Channel#1_5: U_Bank/U_Channel (IC2_U_Bank_U_Channel#1.5), U_Bank/U_Channel/U_Switch (R45_U_Bank_U_Channel_U_Switch#2.2)
NetIC2_U_Bank_U_Channel#1_6: MCU (IC8.29), U_Bank/U_Channel (IC2_U_Bank_U_Channel#1.6 IC2_U_Bank_U_Channel#1.13), U_Bank/U_Channel (IC2_U_Bank_U_Channel#2.6 IC2_U_Bank_U_Channel#2.13), U_Bank/U_Channel (IC2_U_Bank_U_Channel#3.6 IC2_U_Bank_U_Channel#3.13), U_Bank/U_Channel (IC2_U_Bank_U_Channel#4.6 IC2_U_Bank_U_Channel#4.13), U_Bank/U_Channel (IC2_U_Bank_U_Channel#5.6 IC2_U_Bank_U_Channel#5.13), U_Bank/U_Channel (IC2_U_Bank_U_Channel#6.6 IC2_U_Bank_U_Channel#6.13), U_Bank/U_Channel (IC2_U_Bank_U_Channel#7.6 IC2_U_Bank_U_Channel#7.13), U_Bank/U_Channel (IC2_U_Bank_U_Channel#8.6 IC2_U_Bank_U_Channel#8.13), U_Bank/U_Channel (IC2_U_Bank_U_Channel#9.6 IC2_U_Bank_U_Channel#9.13), U_Bank/U_Channel (IC2_U_Bank_U_Channel#10.6 IC2_U_Bank_U_Channel#10.13), U_Bank/U_Channel (IC2_U_Bank_U_Channel#11.6 IC2_U_Bank_U_Channel#11.13), U_Bank/U_Channel (IC2_U_Bank_U_Channel#12.6 IC2_U_Bank_U_Channel#12.13), U_Bank/U_Channel (IC2_U_Bank_U_Channel#13.6 IC2_U_Bank_U_Channel#13.13), U_Bank/U_Channel (IC2_U_Bank_U_Channel#14.6 IC2_U_Bank_U_Channel#14.13), U_Bank/U_Channel (IC2_U_Bank_U_Channel#15.6 IC2_U_Bank_U_Channel#15.13), U_Bank/U_Channel (IC2_U_Bank_U_Channel#16.6 IC2_U_Bank_U_Channel#16.13), U_Bank/U_Channel (IC2_U_Bank_U_Channel#17.6 IC2_U_Bank_U_Channel#17.13), U_Bank/U_Channel (IC2_U_Bank_U_Channel#18.6 IC2_U_Bank_U_Channel#18.13), U_Bank/U_Channel (IC2_U_Bank_U_Channel#19.6 IC2_U_Bank_U_Channel#19.13), U_Bank/U_Channel (IC2_U_Bank_U_Channel#20.6 IC2_U_Bank_U_Channel#20.13), U_Bank/U_Channel (IC2_U_Bank_U_Channel#21.6 IC2_U_Bank_U_Channel#21.13), U_Bank/U_Channel (IC2_U_Bank_U_Channel#22.6 IC2_U_Bank_U_Channel#22.13), U_Bank/U_Channel (IC2_U_Bank_U_Channel#23.6 IC2_U_Bank_U_Channel#23.13), U_Bank/U_Channel (IC2_U_Bank_U_Channel#24.6 IC2_U_Bank_U_Channel#24.13)
NetIC2_U_Bank_U_Channel#1_7: U_Bank/U_Channel (IC2_U_Bank_U_Channel#1.7), U_Bank/U_Channel/U_Switch (IC13_U_Bank_U_Channel_U_Switch#2.4 R33_U_Bank_U_Channel_U_Switch#2.2)
NetIC2_U_Bank_U_Channel#1_8: U_Bank/U_Channel (IC2_U_Bank_U_Channel#1.8), U_Bank/U_Channel/U_Switch (IC15_U_Bank_U_Channel_U_Switch#1.5 LD5_U_Bank_U_Channel_U_Switch#1.2 T7_U_Bank_U_Channel_U_Switch#1.1)
NetIC2_U_Bank_U_Channel#1_11: U_Bank/U_Channel (IC2_U_Bank_U_Channel#1.11), U_Bank/U_Channel/U_Switch (IC15_U_Bank_U_Channel_U_Switch#2.5 LD5_U_Bank_U_Channel_U_Switch#2.2 T7_U_Bank_U_Channel_U_Switch#2.1)
NetIC2_U_Bank_U_Channel#1_14: U_Bank/U_Channel (IC2_U_Bank_U_Channel#1.14), U_Bank/U_Channel/U_Switch (IC13_U_Bank_U_Channel_U_Switch#1.4 R33_U_Bank_U_Channel_U_Switch#1.2)
NetIC2_U_Bank_U_Channel#1_16: U_Bank/U_Channel (IC2_U_Bank_U_Channel#1.16), U_Bank/U_Channel/U_Switch (R45_U_Bank_U_Channel_U_Switch#1.2)
NetIC2_U_Bank_U_Channel#1_18: U_Bank/U_Channel (IC2_U_Bank_U_Channel#1.18), U_Bank/U_Channel/U_Switch (R46_U_Bank_U_Channel_U_Switch#1.2)
NetIC2_U_Bank_U_Channel#2_3: U_Bank/U_Channel (IC2_U_Bank_U_Channel#2.3), U_Bank/U_Channel/U_Switch (R46_U_Bank_U_Channel_U_Switch#4.2)
NetIC2_U_Bank_U_Channel#2_5: U_Bank/U_Channel (IC2_U_Bank_U_Channel#2.5), U_Bank/U_Channel/U_Switch (R45_U_Bank_U_Channel_U_Switch#4.2)
NetIC2_U_Bank_U_Channel#2_7: U_Bank/U_Channel (IC2_U_Bank_U_Channel#2.7), U_Bank/U_Channel/U_Switch (IC13_U_Bank_U_Channel_U_Switch#4.4 R33_U_Bank_U_Channel_U_Switch#4.2)
NetIC2_U_Bank_U_Channel#2_8: U_Bank/U_Channel (IC2_U_Bank_U_Channel#2.8), U_Bank/U_Channel/U_Switch (IC15_U_Bank_U_Channel_U_Switch#3.5 LD5_U_Bank_U_Channel_U_Switch#3.2 T7_U_Bank_U_Channel_U_Switch#3.1)
NetIC2_U_Bank_U_Channel#2_11: U_Bank/U_Channel (IC2_U_Bank_U_Channel#2.11), U_Bank/U_Channel/U_Switch (IC15_U_Bank_U_Channel_U_Switch#4.5 LD5_U_Bank_U_Channel_U_Switch#4.2 T7_U_Bank_U_Channel_U_Switch#4.1)
NetIC2_U_Bank_U_Channel#2_14: U_Bank/U_Channel (IC2_U_Bank_U_Channel#2.14), U_Bank/U_Channel/U_Switch (IC13_U_Bank_U_Channel_U_Switch#3.4 R33_U_Bank_U_Channel_U_Switch#3.2)
NetIC2_U_Bank_U_Channel#2_16: U_Bank/U_Channel (IC2_U_Bank_U_Channel#2.16), U_Bank/U_Channel/U_Switch (R45_U_Bank_U_Channel_U_Switch#3.2)
NetIC2_U_Bank_U_Channel#2_18: U_Bank/U_Channel (IC2_U_Bank_U_Channel#2.18), U_Bank/U_Channel/U_Switch (R46_U_Bank_U_Channel_U_Switch#3.2)
NetIC2_U_Bank_U_Channel#3_3: U_Bank/U_Channel (IC2_U_Bank_U_Channel#3.3), U_Bank/U_Channel/U_Switch (R46_U_Bank_U_Channel_U_Switch#6.2)
NetIC2_U_Bank_U_Channel#3_5: U_Bank/U_Channel (IC2_U_Bank_U_Channel#3.5), U_Bank/U_Channel/U_Switch (R45_U_Bank_U_Channel_U_Switch#6.2)
NetIC2_U_Bank_U_Channel#3_7: U_Bank/U_Channel (IC2_U_Bank_U_Channel#3.7), U_Bank/U_Channel/U_Switch (IC13_U_Bank_U_Channel_U_Switch#6.4 R33_U_Bank_U_Channel_U_Switch#6.2)
NetIC2_U_Bank_U_Channel#3_8: U_Bank/U_Channel (IC2_U_Bank_U_Channel#3.8), U_Bank/U_Channel/U_Switch (IC15_U_Bank_U_Channel_U_Switch#5.5 LD5_U_Bank_U_Channel_U_Switch#5.2 T7_U_Bank_U_Channel_U_Switch#5.1)
NetIC2_U_Bank_U_Channel#3_11: U_Bank/U_Channel (IC2_U_Bank_U_Channel#3.11), U_Bank/U_Channel/U_Switch (IC15_U_Bank_U_Channel_U_Switch#6.5 LD5_U_Bank_U_Channel_U_Switch#6.2 T7_U_Bank_U_Channel_U_Switch#6.1)
NetIC2_U_Bank_U_Channel#3_14: U_Bank/U_Channel (IC2_U_Bank_U_Channel#3.14), U_Bank/U_Channel/U_Switch (IC13_U_Bank_U_Channel_U_Switch#5.4 R33_U_Bank_U_Channel_U_Switch#5.2)
NetIC2_U_Bank_U_Channel#3_16: U_Bank/U_Channel (IC2_U_Bank_U_Channel#3.16), U_Bank/U_Channel/U_Switch (R45_U_Bank_U_Channel_U_Switch#5.2)
NetIC2_U_Bank_U_Channel#3_18: U_Bank/U_Channel (IC2_U_Bank_U_Channel#3.18), U_Bank/U_Channel/U_Switch (R46_U_Bank_U_Channel_U_Switch#5.2)
NetIC2_U_Bank_U_Channel#4_3: U_Bank/U_Channel (IC2_U_Bank_U_Channel#4.3), U_Bank/U_Channel/U_Switch (R46_U_Bank_U_Channel_U_Switch#8.2)
NetIC2_U_Bank_U_Channel#4_5: U_Bank/U_Channel (IC2_U_Bank_U_Channel#4.5), U_Bank/U_Channel/U_Switch (R45_U_Bank_U_Channel_U_Switch#8.2)
NetIC2_U_Bank_U_Channel#4_7: U_Bank/U_Channel (IC2_U_Bank_U_Channel#4.7), U_Bank/U_Channel/U_Switch (IC13_U_Bank_U_Channel_U_Switch#8.4 R33_U_Bank_U_Channel_U_Switch#8.2)
NetIC2_U_Bank_U_Channel#4_8: U_Bank/U_Channel (IC2_U_Bank_U_Channel#4.8), U_Bank/U_Channel/U_Switch (IC15_U_Bank_U_Channel_U_Switch#7.5 LD5_U_Bank_U_Channel_U_Switch#7.2 T7_U_Bank_U_Channel_U_Switch#7.1)
NetIC2_U_Bank_U_Channel#4_11: U_Bank/U_Channel (IC2_U_Bank_U_Channel#4.11), U_Bank/U_Channel/U_Switch (IC15_U_Bank_U_Channel_U_Switch#8.5 LD5_U_Bank_U_Channel_U_Switch#8.2 T7_U_Bank_U_Channel_U_Switch#8.1)
NetIC2_U_Bank_U_Channel#4_14: U_Bank/U_Channel (IC2_U_Bank_U_Channel#4.14), U_Bank/U_Channel/U_Switch (IC13_U_Bank_U_Channel_U_Switch#7.4 R33_U_Bank_U_Channel_U_Switch#7.2)
NetIC2_U_Bank_U_Channel#4_16: U_Bank/U_Channel (IC2_U_Bank_U_Channel#4.16), U_Bank/U_Channel/U_Switch (R45_U_Bank_U_Channel_U_Switch#7.2)
NetIC2_U_Bank_U_Channel#4_18: U_Bank/U_Channel (IC2_U_Bank_U_Channel#4.18), U_Bank/U_Channel/U_Switch (R46_U_Bank_U_Channel_U_Switch#7.2)
NetIC2_U_Bank_U_Channel#5_3: U_Bank/U_Channel (IC2_U_Bank_U_Channel#5.3), U_Bank/U_Channel/U_Switch (R46_U_Bank_U_Channel_U_Switch#10.2)
NetIC2_U_Bank_U_Channel#5_5: U_Bank/U_Channel (IC2_U_Bank_U_Channel#5.5), U_Bank/U_Channel/U_Switch (R45_U_Bank_U_Channel_U_Switch#10.2)
NetIC2_U_Bank_U_Channel#5_7: U_Bank/U_Channel (IC2_U_Bank_U_Channel#5.7), U_Bank/U_Channel/U_Switch (IC13_U_Bank_U_Channel_U_Switch#10.4 R33_U_Bank_U_Channel_U_Switch#10.2)
NetIC2_U_Bank_U_Channel#5_8: U_Bank/U_Channel (IC2_U_Bank_U_Channel#5.8), U_Bank/U_Channel/U_Switch (IC15_U_Bank_U_Channel_U_Switch#9.5 LD5_U_Bank_U_Channel_U_Switch#9.2 T7_U_Bank_U_Channel_U_Switch#9.1)
NetIC2_U_Bank_U_Channel#5_11: U_Bank/U_Channel (IC2_U_Bank_U_Channel#5.11), U_Bank/U_Channel/U_Switch (IC15_U_Bank_U_Channel_U_Switch#10.5 LD5_U_Bank_U_Channel_U_Switch#10.2 T7_U_Bank_U_Channel_U_Switch#10.1)
NetIC2_U_Bank_U_Channel#5_14: U_Bank/U_Channel (IC2_U_Bank_U_Channel#5.14), U_Bank/U_Channel/U_Switch (IC13_U_Bank_U_Channel_U_Switch#9.4 R33_U_Bank_U_Channel_U_Switch#9.2)
NetIC2_U_Bank_U_Channel#5_16: U_Bank/U_Channel (IC2_U_Bank_U_Channel#5.16), U_Bank/U_Channel/U_Switch (R45_U_Bank_U_Channel_U_Switch#9.2)
NetIC2_U_Bank_U_Channel#5_18: U_Bank/U_Channel (IC2_U_Bank_U_Channel#5.18), U_Bank/U_Channel/U_Switch (R46_U_Bank_U_Channel_U_Switch#9.2)
NetIC2_U_Bank_U_Channel#6_3: U_Bank/U_Channel (IC2_U_Bank_U_Channel#6.3), U_Bank/U_Channel/U_Switch (R46_U_Bank_U_Channel_U_Switch#12.2)
NetIC2_U_Bank_U_Channel#6_5: U_Bank/U_Channel (IC2_U_Bank_U_Channel#6.5), U_Bank/U_Channel/U_Switch (R45_U_Bank_U_Channel_U_Switch#12.2)
NetIC2_U_Bank_U_Channel#6_7: U_Bank/U_Channel (IC2_U_Bank_U_Channel#6.7), U_Bank/U_Channel/U_Switch (IC13_U_Bank_U_Channel_U_Switch#12.4 R33_U_Bank_U_Channel_U_Switch#12.2)
NetIC2_U_Bank_U_Channel#6_8: U_Bank/U_Channel (IC2_U_Bank_U_Channel#6.8), U_Bank/U_Channel/U_Switch (IC15_U_Bank_U_Channel_U_Switch#11.5 LD5_U_Bank_U_Channel_U_Switch#11.2 T7_U_Bank_U_Channel_U_Switch#11.1)
NetIC2_U_Bank_U_Channel#6_11: U_Bank/U_Channel (IC2_U_Bank_U_Channel#6.11), U_Bank/U_Channel/U_Switch (IC15_U_Bank_U_Channel_U_Switch#12.5 LD5_U_Bank_U_Channel_U_Switch#12.2 T7_U_Bank_U_Channel_U_Switch#12.1)
NetIC2_U_Bank_U_Channel#6_14: U_Bank/U_Channel (IC2_U_Bank_U_Channel#6.14), U_Bank/U_Channel/U_Switch (IC13_U_Bank_U_Channel_U_Switch#11.4 R33_U_Bank_U_Channel_U_Switch#11.2)
NetIC2_U_Bank_U_Channel#6_16: U_Bank/U_Channel (IC2_U_Bank_U_Channel#6.16), U_Bank/U_Channel/U_Switch (R45_U_Bank_U_Channel_U_Switch#11.2)
NetIC2_U_Bank_U_Channel#6_18: U_Bank/U_Channel (IC2_U_Bank_U_Channel#6.18), U_Bank/U_Channel/U_Switch (R46_U_Bank_U_Channel_U_Switch#11.2)
NetIC2_U_Bank_U_Channel#7_3: U_Bank/U_Channel (IC2_U_Bank_U_Channel#7.3), U_Bank/U_Channel/U_Switch (R46_U_Bank_U_Channel_U_Switch#14.2)
NetIC2_U_Bank_U_Channel#7_5: U_Bank/U_Channel (IC2_U_Bank_U_Channel#7.5), U_Bank/U_Channel/U_Switch (R45_U_Bank_U_Channel_U_Switch#14.2)
NetIC2_U_Bank_U_Channel#7_7: U_Bank/U_Channel (IC2_U_Bank_U_Channel#7.7), U_Bank/U_Channel/U_Switch (IC13_U_Bank_U_Channel_U_Switch#14.4 R33_U_Bank_U_Channel_U_Switch#14.2)
NetIC2_U_Bank_U_Channel#7_8: U_Bank/U_Channel (IC2_U_Bank_U_Channel#7.8), U_Bank/U_Channel/U_Switch (IC15_U_Bank_U_Channel_U_Switch#13.5 LD5_U_Bank_U_Channel_U_Switch#13.2 T7_U_Bank_U_Channel_U_Switch#13.1)
NetIC2_U_Bank_U_Channel#7_11: U_Bank/U_Channel (IC2_U_Bank_U_Channel#7.11), U_Bank/U_Channel/U_Switch (IC15_U_Bank_U_Channel_U_Switch#14.5 LD5_U_Bank_U_Channel_U_Switch#14.2 T7_U_Bank_U_Channel_U_Switch#14.1)
NetIC2_U_Bank_U_Channel#7_14: U_Bank/U_Channel (IC2_U_Bank_U_Channel#7.14), U_Bank/U_Channel/U_Switch (IC13_U_Bank_U_Channel_U_Switch#13.4 R33_U_Bank_U_Channel_U_Switch#13.2)
NetIC2_U_Bank_U_Channel#7_16: U_Bank/U_Channel (IC2_U_Bank_U_Channel#7.16), U_Bank/U_Channel/U_Switch (R45_U_Bank_U_Channel_U_Switch#13.2)
NetIC2_U_Bank_U_Channel#7_18: U_Bank/U_Channel (IC2_U_Bank_U_Channel#7.18), U_Bank/U_Channel/U_Switch (R46_U_Bank_U_Channel_U_Switch#13.2)
NetIC2_U_Bank_U_Channel#8_3: U_Bank/U_Channel (IC2_U_Bank_U_Channel#8.3), U_Bank/U_Channel/U_Switch (R46_U_Bank_U_Channel_U_Switch#16.2)
NetIC2_U_Bank_U_Channel#8_5: U_Bank/U_Channel (IC2_U_Bank_U_Channel#8.5), U_Bank/U_Channel/U_Switch (R45_U_Bank_U_Channel_U_Switch#16.2)
NetIC2_U_Bank_U_Channel#8_7: U_Bank/U_Channel (IC2_U_Bank_U_Channel#8.7), U_Bank/U_Channel/U_Switch (IC13_U_Bank_U_Channel_U_Switch#16.4 R33_U_Bank_U_Channel_U_Switch#16.2)
NetIC2_U_Bank_U_Channel#8_8: U_Bank/U_Channel (IC2_U_Bank_U_Channel#8.8), U_Bank/U_Channel/U_Switch (IC15_U_Bank_U_Channel_U_Switch#15.5 LD5_U_Bank_U_Channel_U_Switch#15.2 T7_U_Bank_U_Channel_U_Switch#15.1)
NetIC2_U_Bank_U_Channel#8_11: U_Bank/U_Channel (IC2_U_Bank_U_Channel#8.11), U_Bank/U_Channel/U_Switch (IC15_U_Bank_U_Channel_U_Switch#16.5 LD5_U_Bank_U_Channel_U_Switch#16.2 T7_U_Bank_U_Channel_U_Switch#16.1)
NetIC2_U_Bank_U_Channel#8_14: U_Bank/U_Channel (IC2_U_Bank_U_Channel#8.14), U_Bank/U_Channel/U_Switch (IC13_U_Bank_U_Channel_U_Switch#15.4 R33_U_Bank_U_Channel_U_Switch#15.2)
NetIC2_U_Bank_U_Channel#8_16: U_Bank/U_Channel (IC2_U_Bank_U_Channel#8.16), U_Bank/U_Channel/U_Switch (R45_U_Bank_U_Channel_U_Switch#15.2)
NetIC2_U_Bank_U_Channel#8_18: U_Bank/U_Channel (IC2_U_Bank_U_Channel#8.18), U_Bank/U_Channel/U_Switch (R46_U_Bank_U_Channel_U_Switch#15.2)
NetIC2_U_Bank_U_Channel#9_3: U_Bank/U_Channel (IC2_U_Bank_U_Channel#9.3), U_Bank/U_Channel/U_Switch (R46_U_Bank_U_Channel_U_Switch#18.2)
NetIC2_U_Bank_U_Channel#9_5: U_Bank/U_Channel (IC2_U_Bank_U_Channel#9.5), U_Bank/U_Channel/U_Switch (R45_U_Bank_U_Channel_U_Switch#18.2)
NetIC2_U_Bank_U_Channel#9_7: U_Bank/U_Channel (IC2_U_Bank_U_Channel#9.7), U_Bank/U_Channel/U_Switch (IC13_U_Bank_U_Channel_U_Switch#18.4 R33_U_Bank_U_Channel_U_Switch#18.2)
NetIC2_U_Bank_U_Channel#9_8: U_Bank/U_Channel (IC2_U_Bank_U_Channel#9.8), U_Bank/U_Channel/U_Switch (IC15_U_Bank_U_Channel_U_Switch#17.5 LD5_U_Bank_U_Channel_U_Switch#17.2 T7_U_Bank_U_Channel_U_Switch#17.1)
NetIC2_U_Bank_U_Channel#9_11: U_Bank/U_Channel (IC2_U_Bank_U_Channel#9.11), U_Bank/U_Channel/U_Switch (IC15_U_Bank_U_Channel_U_Switch#18.5 LD5_U_Bank_U_Channel_U_Switch#18.2 T7_U_Bank_U_Channel_U_Switch#18.1)
NetIC2_U_Bank_U_Channel#9_14: U_Bank/U_Channel (IC2_U_Bank_U_Channel#9.14), U_Bank/U_Channel/U_Switch (IC13_U_Bank_U_Channel_U_Switch#17.4 R33_U_Bank_U_Channel_U_Switch#17.2)
NetIC2_U_Bank_U_Channel#9_16: U_Bank/U_Channel (IC2_U_Bank_U_Channel#9.16), U_Bank/U_Channel/U_Switch (R45_U_Bank_U_Channel_U_Switch#17.2)
NetIC2_U_Bank_U_Channel#9_18: U_Bank/U_Channel (IC2_U_Bank_U_Channel#9.18), U_Bank/U_Channel/U_Switch (R46_U_Bank_U_Channel_U_Switch#17.2)
NetIC2_U_Bank_U_Channel#10_3: U_Bank/U_Channel (IC2_U_Bank_U_Channel#10.3), U_Bank/U_Channel/U_Switch (R46_U_Bank_U_Channel_U_Switch#20.2)
NetIC2_U_Bank_U_Channel#10_5: U_Bank/U_Channel (IC2_U_Bank_U_Channel#10.5), U_Bank/U_Channel/U_Switch (R45_U_Bank_U_Channel_U_Switch#20.2)
NetIC2_U_Bank_U_Channel#10_7: U_Bank/U_Channel (IC2_U_Bank_U_Channel#10.7), U_Bank/U_Channel/U_Switch (IC13_U_Bank_U_Channel_U_Switch#20.4 R33_U_Bank_U_Channel_U_Switch#20.2)
NetIC2_U_Bank_U_Channel#10_8: U_Bank/U_Channel (IC2_U_Bank_U_Channel#10.8), U_Bank/U_Channel/U_Switch (IC15_U_Bank_U_Channel_U_Switch#19.5 LD5_U_Bank_U_Channel_U_Switch#19.2 T7_U_Bank_U_Channel_U_Switch#19.1)
NetIC2_U_Bank_U_Channel#10_11: U_Bank/U_Channel (IC2_U_Bank_U_Channel#10.11), U_Bank/U_Channel/U_Switch (IC15_U_Bank_U_Channel_U_Switch#20.5 LD5_U_Bank_U_Channel_U_Switch#20.2 T7_U_Bank_U_Channel_U_Switch#20.1)
NetIC2_U_Bank_U_Channel#10_14: U_Bank/U_Channel (IC2_U_Bank_U_Channel#10.14), U_Bank/U_Channel/U_Switch (IC13_U_Bank_U_Channel_U_Switch#19.4 R33_U_Bank_U_Channel_U_Switch#19.2)
NetIC2_U_Bank_U_Channel#10_16: U_Bank/U_Channel (IC2_U_Bank_U_Channel#10.16), U_Bank/U_Channel/U_Switch (R45_U_Bank_U_Channel_U_Switch#19.2)
NetIC2_U_Bank_U_Channel#10_18: U_Bank/U_Channel (IC2_U_Bank_U_Channel#10.18), U_Bank/U_Channel/U_Switch (R46_U_Bank_U_Channel_U_Switch#19.2)
NetIC2_U_Bank_U_Channel#11_3: U_Bank/U_Channel (IC2_U_Bank_U_Channel#11.3), U_Bank/U_Channel/U_Switch (R46_U_Bank_U_Channel_U_Switch#22.2)
NetIC2_U_Bank_U_Channel#11_5: U_Bank/U_Channel (IC2_U_Bank_U_Channel#11.5), U_Bank/U_Channel/U_Switch (R45_U_Bank_U_Channel_U_Switch#22.2)